# EAGLE design usb_blaster_rev_a (EAGLE 6.4)
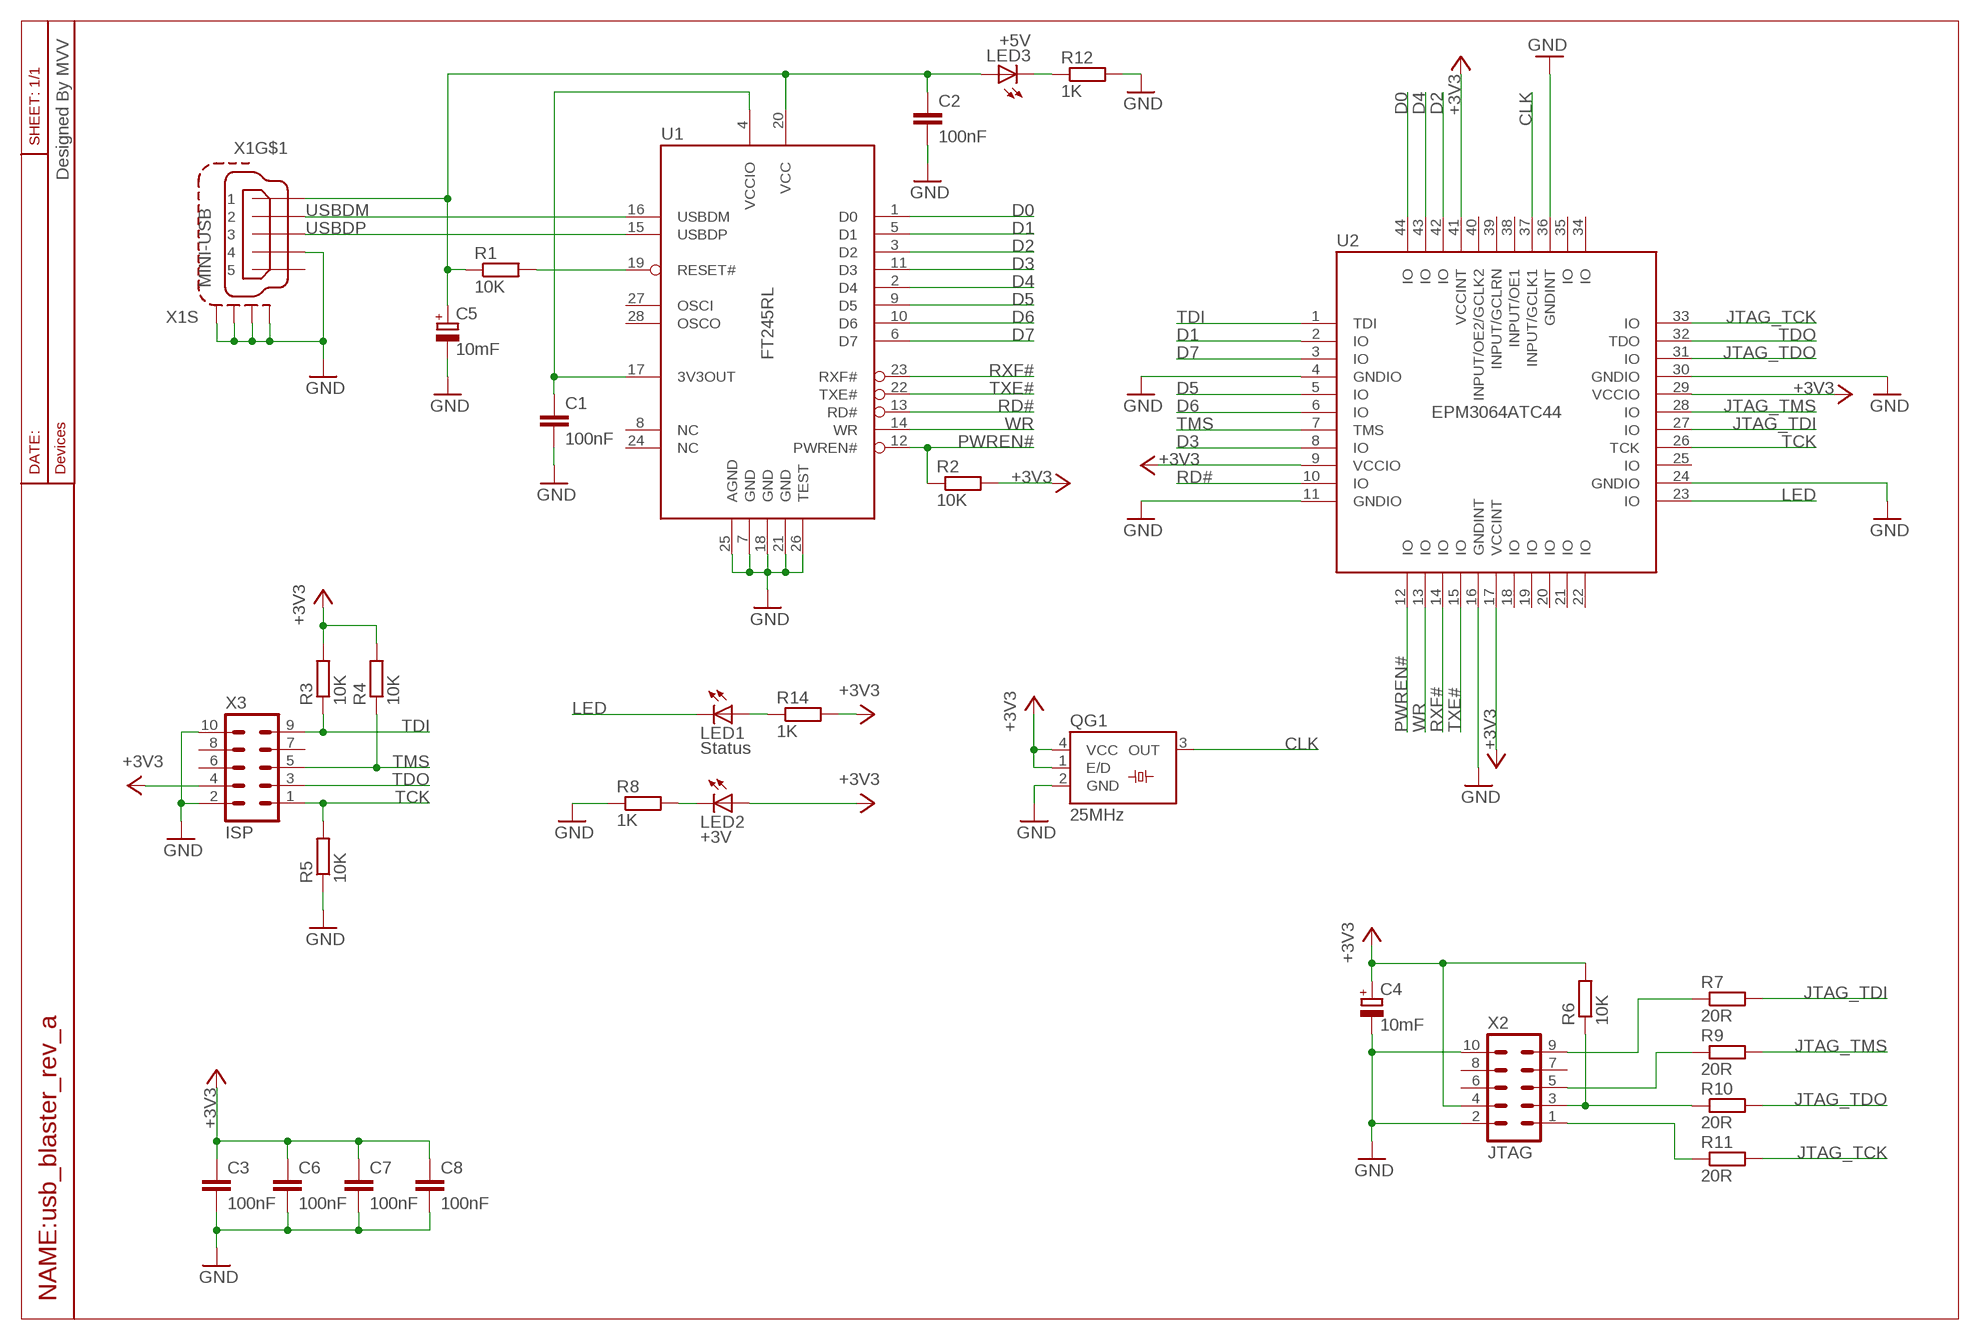
[diagram p0: schematic, sheet 1]

## Parts
C1  100nF  C-EUC0805  [C0805]
C2  100nF  C-EUC0805  [C0805]
C3  100nF  C-EUC0805  [C0805]
C4  10mF  CPOL-EUCT6032  [CT6032]
C5  10mF  CPOL-EUCT6032  [CT6032]
C6  100nF  C-EUC0805  [C0805]
C7  100nF  C-EUC0805  [C0805]
C8  100nF  C-EUC0805  [C0805]
LED1  Status  LED3MM  [LED3MM]
LED2  +3V  LED3MM  [LED3MM]
LED3  +5V  LED3MM  [LED3MM]
QG1  25MHz  SM77H  [SM77H]
R1  10K  R-EU_R0805  [R0805]
R2  10K  R-EU_R0805  [R0805]
R3  10K  R-EU_R0805  [R0805]
R4  10K  R-EU_R0805  [R0805]
R5  10K  R-EU_R0805  [R0805]
R6  10K  R-EU_R0805  [R0805]
R7  20R  R-EU_R0805  [R0805]
R8  1K  R-EU_R0805  [R0805]
R9  20R  R-EU_R0805  [R0805]
R10  20R  R-EU_R0805  [R0805]
R11  20R  R-EU_R0805  [R0805]
R12  1K  R-EU_R0805  [R0805]
R14  1K  R-EU_R0805  [R0805]
U1  FT245RL  [SSOP28]
U2  EPM3064ATC44  [TQFP44]
X1  MINI-USB  MINI-USB-SCHIELD-32005-201  [32005-201]
X2  JTAG  ML10  [ML10]
X3  ISP  MA05-2  [MA05-2]

## Nets
3V3OUT: C1.1 U1.4(VCCIO) U1.17(3V3OUT)
+3V3: C3.1 C4.+ C6.1 C7.1 C8.1 LED2.A QG1.1(E/D) QG1.4(VCC) R2.2 R3.2 R4.2 R6.2 R14.2 U2.9(VCCIO) U2.17(VCCINT) U2.29(VCCIO) U2.41(VCCINT) X2.4 X3.4
+5V: C2.1 C5.+ LED3.A R1.1 U1.20(VCC) X1.1
CLK: QG1.3(OUT) U2.37(INPUT/GCLK1)
D0: U1.1(D0) U2.44(IO)
D1: U1.5(D1) U2.2(IO)
D2: U1.3(D2) U2.42(IO)
D3: U1.11(D3) U2.8(IO)
D4: U1.2(D4) U2.43(IO)
D5: U1.9(D5) U2.5(IO)
D6: U1.10(D6) U2.6(IO)
D7: U1.6(D7) U2.3(IO)
GND: C1.2 C2.2 C3.2 C4.- C5.- C6.2 C7.2 C8.2 QG1.2(GND) R5.1 R8.1 R12.2 U1.7(GND) U1.18(GND) U1.21(GND) U1.25(AGND) U1.26(TEST) U2.4(GNDIO) U2.11(GNDIO) U2.16(GNDINT) U2.24(GNDIO) U2.30(GNDIO) U2.36(GNDINT) X1.4 X1.M1(S:S1) X1.M2(S:S2) X1.M3(S:S3) X1.M4(S:S4) X2.2 X2.10 X3.2 X3.10
JTAG_TCK: R11.2 U2.33(IO)
JTAG_TDI: R7.2 U2.27(IO)
JTAG_TDO: R10.2 U2.31(IO)
JTAG_TMS: R9.2 U2.28(IO)
LED: LED1.K(C) U2.23(IO)
N$1: LED3.K(C) R12.1
N$2: R1.2 U1.19(RESET#)
N$3: R7.1 X2.9
N$4: R11.1 X2.1
N$5: R6.1 R10.1 X2.3
N$6: R9.1 X2.5
N$7: LED2.K(C) R8.2
N$10: LED1.A R14.1
PWREN#: R2.1 U1.12(PWREN#) U2.12(IO)
RD#: U1.13(RD#) U2.10(IO)
RXF#: U1.23(RXF#) U2.14(IO)
TCK: R5.2 U2.26(TCK) X3.1
TDI: R3.1 U2.1(TDI) X3.9
TDO: U2.32(TDO) X3.3
TMS: R4.1 U2.7(TMS) X3.5
TXE#: U1.22(TXE#) U2.15(IO)
USBDM: U1.16(USBDM) X1.2
USBDP: U1.15(USBDP) X1.3
WR: U1.14(WR) U2.13(IO)
Unconnected: U1.8(NC) U1.24(NC) U1.27(OSCI) U1.28(OSCO) U2.18(IO) U2.19(IO) U2.20(IO) U2.21(IO) U2.22(IO) U2.25(IO) U2.34(IO) U2.35(IO) U2.38(INPUT/OE1) U2.39(INPUT/GCLRN) U2.40(INPUT/OE2/GCLK2) X1.5 X2.6 X2.7 X2.8 X3.6 X3.7 X3.8

## Notes on the sheet
- Designed By MVV

## Library data of the parts
C1-C3 C6-C8 = rcl:C-EU: CAPACITOR, European symbol
C4 C5 = rcl:CPOL-EU: POLARIZED CAPACITOR, European symbol
LED1-LED3 = led:LED: LED OSRAM: - CHIPLED LG R971, LG N971, LY N971, LG Q971, LY Q971, LO R971, LY R971 LH N974, LH R974 LS Q976, LO Q976, LY Q976 LO Q996 - Hyper CHIPLED LW Q18S LB Q993, LB Q99A, LB R99A - SideLED LS A670, LO A670, LY A670, LG A670, LP A670 LB A673, LV A673, LT A673, LW A673 LH A674 LY A675 LS A676, LA A676, LO A676, LY A676, LW A676 LS A679, LY A679, LG A679 - Hyper Micro SIDELED® LS Y876, LA Y876, LO Y876, LY Y876 LT Y87S - SmartLED LW L88C, LW L88S LB L89C, LB L89S, LG L890 LS L89K, LO L89K, LY L89K LS L896, LA L896, LO L896, LY L896 - TOPLED LS T670, LO T670, LY T670, LG T670, LP T670 LSG T670, LSP T670, LSY T670, LOP T670, LYG T670 LG T671, LOG T671, LSG T671 LB T673, LV T673, LT T673, LW T673 LH T674 LS T676, LA T676, LO T676, LY T676, LB T676, LH T676, LSB T676, LW T676 LB T67C, LV T67C, LT T67C, LS T67K, LO T67K, LY T67K, LW E67C LS E67B, LA E67B, LO E67B, LY E67B, LB E67C, LV E67C, LT E67C LW T67C LS T679, LY T679, LG T679 LS T770, LO T770, LY T770, LG T770, LP T770 LB T773, LV T773, LT T773, LW T773 LH T774 LS E675, LA E675, LY E675, LS T675 LS T776, LA T776, LO T776, LY T776, LB T776 LHGB T686 LT T68C, LB T68C - Hyper Mini TOPLED® LB M676 - Mini TOPLED Santana® LG M470 LS M47K, LO M47K, LY M47K Source: http://www.osram.convergy.de LUXEON: - LUMILED® LXK2-PW12-R00, LXK2-PW12-S00, LXK2-PW14-U00, LXK2-PW14-V00 LXK2-PM12-R00, LXK2-PM12-S00, LXK2-PM14-U00 LXK2-PE12-Q00, LXK2-PE12-R00, LXK2-PE12-S00, LXK2-PE14-T00, LXK2-PE14-U00 LXK2-PB12-K00, LXK2-PB12-L00, LXK2-PB12-M00, LXK2-PB14-N00, LXK2-PB14-P00, LXK2-PB14-Q00 LXK2-PR12-L00, LXK2-PR12-M00, LXK2-PR14-Q00, LXK2-PR14-R00 LXK2-PD12-Q00, LXK2-PD12-R00, LXK2-PD12-S00 LXK2-PH12-R00, LXK2-PH12-S00 LXK2-PL12-P00, LXK2-PL12-Q00, LXK2-PL12-R00 Source: www.luxeon.com KINGBRIGHT: KA-3528ASYC Source: www.kingbright.com
QG1 = crystal:SM77H: 3.3V CMOS Clock Oscillator Source: www.pletronics.com .. sm77h%203.3v.pdf
R1-R12 R14 = rcl:R-EU_: RESISTOR, European symbol
U1 = ftdichip:FT245R: Single chip USB to parallel FIFO bidirectional data transfer interface.
U2 = altera:EPM3064ATC44: EPM3064A
X1 = con-cypressindustries:MINI-USB-SCHIELD-: MINI USB-B Conector Source: www.cypressindustries.com; OC_FARNELL: unknown; OC_NEWARK: unknown
X2 = con-ml:ML10: HARTING
X3 = con-lstb:MA05-2: PIN HEADER; OC_FARNELL: unknown; OC_NEWARK: unknown

## Board
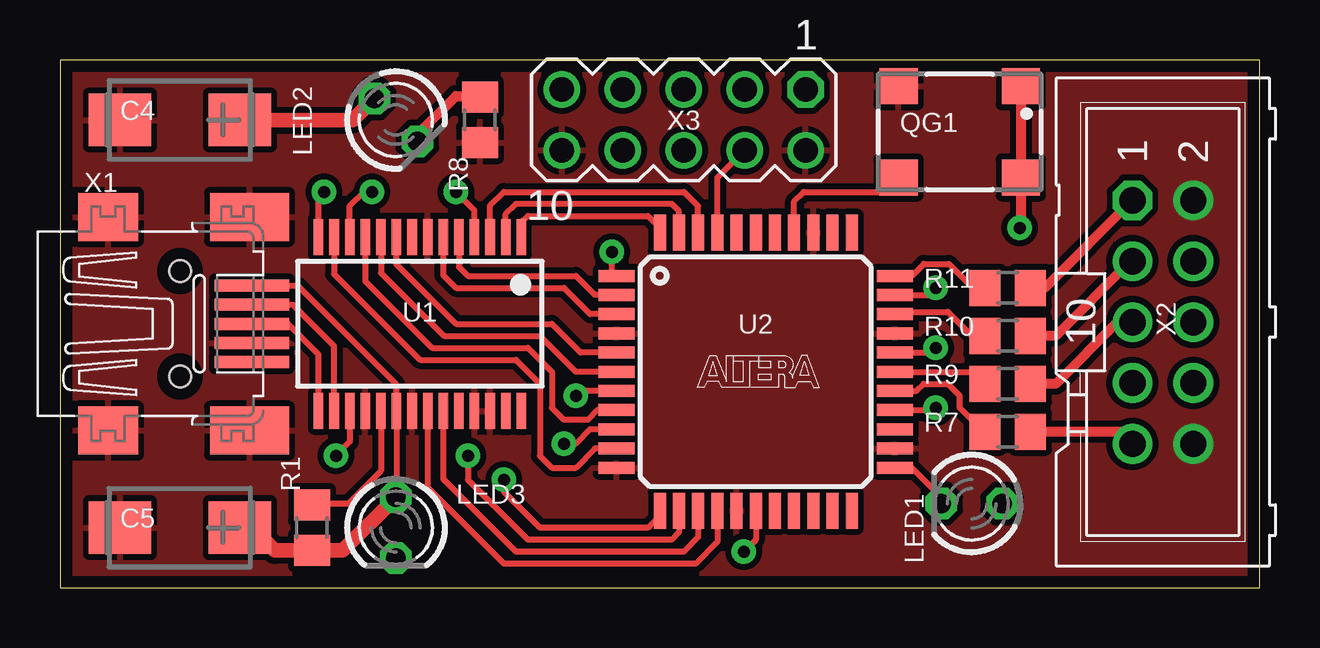
[diagram p1: board, top side]
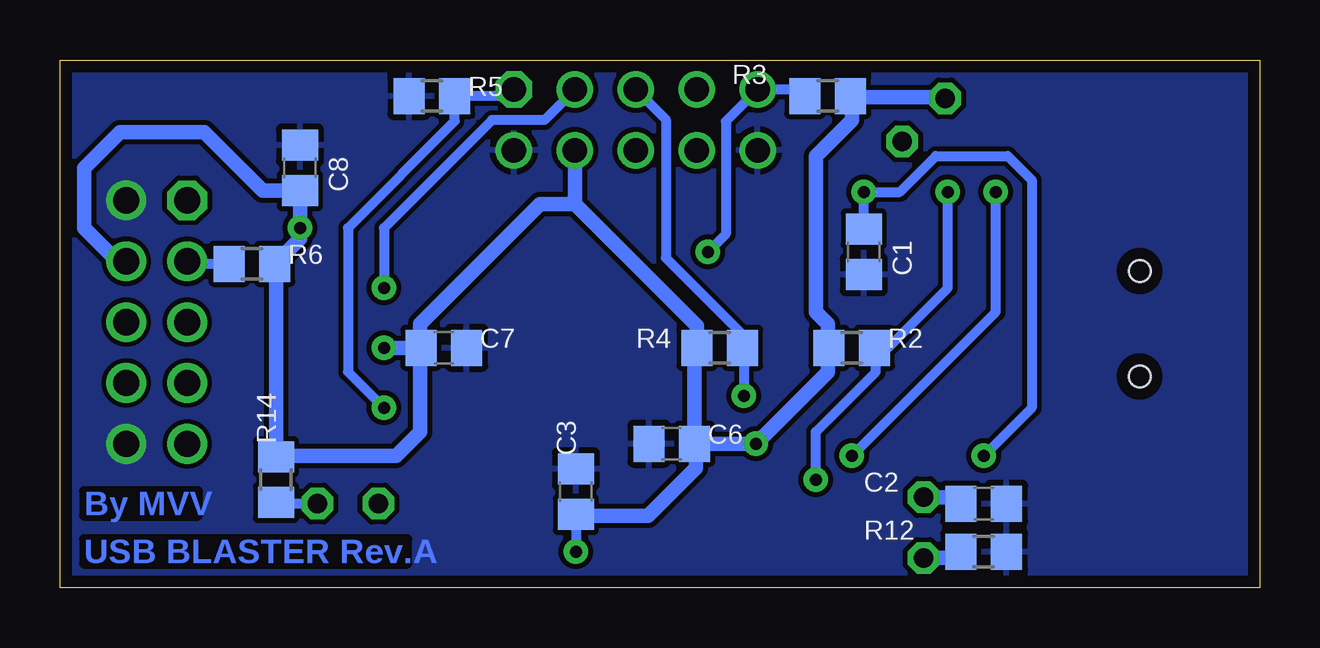
[diagram p2: board, bottom side, seen from below]

Size 50 x 22 mm. Coordinates in mm from the lower left corner, seen from the top.
Outline: 0,0 50,0 50,22 0,22 0,0
Copper layers (1*16): Top 0.035mm / dielectric 1.5mm / Bottom 0.035mm
Design rules "default *": minimum track width 10mil, minimum drill 24mil, track to track 8mil, track to pad 8mil, pad to pad 8mil, via to via 8mil, smd to smd 8mil, copper to edge 0.5mm, drill to drill 8mil, minimum pad ring 10mil, minimum via ring 8mil, stop-mask expansion 4mil, vias tented up to drill 0mil, thermal gap 10mil

### Footprints (pad centres in the part's own frame; a part is rotated, then mirrored left to right if it is on the bottom)
C0805 = smd 1.3 x 1.5: 1 -0.95,0; 2 0.95,0
CT6032 = smd 2.6 x 2.2: + -2.5,0; - 2.5,0
LED3MM = drill 0.813 octagon: A -1.27,0; K 1.27,0
SM77H = smd 1.6 x 1.5: 1 -2.55,-1.9; 2 2.55,-1.9; 3 2.55,1.9; 4 -2.55,1.9
R0805 = smd 1.3 x 1.5: 1 -0.95,0; 2 0.95,0
SSOP28 = smd 0.4 x 1.5: 1 -4.225,-3.625; 2 -3.575,-3.625; 3 -2.925,-3.625; 4 -2.275,-3.625; 5 -1.625,-3.625; 6 -0.975,-3.625; 7 -0.325,-3.625; 8 0.325,-3.625; 9 0.975,-3.625; 10 1.625,-3.625; 11 2.275,-3.625; 12 2.925,-3.625; 13 3.575,-3.625; 14 4.225,-3.625; 15 4.225,3.625; 16 3.575,3.625; 17 2.925,3.625; 18 2.275,3.625; 19 1.625,3.625; 20 0.975,3.625; 21 0.325,3.625; 22 -0.325,3.625; 23 -0.975,3.625; 24 -1.625,3.625; 25 -2.275,3.625; 26 -2.925,3.625; 27 -3.575,3.625; 28 -4.225,3.625
TQFP44 = smd 1.5 x 0.5: 1 -5.8,4; 2 -5.8,3.2; 3 -5.8,2.4; 4 -5.8,1.6; 5 -5.8,0.8; 6 -5.8,0; 7 -5.8,-0.8; 8 -5.8,-1.6; 9 -5.8,-2.4; 10 -5.8,-3.2; 11 -5.8,-4; 23 5.8,-4; 24 5.8,-3.2; 25 5.8,-2.4; 26 5.8,-1.6; 27 5.8,-0.8; 28 5.8,0; 29 5.8,0.8; 30 5.8,1.6; 31 5.8,2.4; 32 5.8,3.2; 33 5.8,4 | smd 0.5 x 1.5: 12 -4,-5.8; 13 -3.2,-5.8; 14 -2.4,-5.8; 15 -1.6,-5.8; 16 -0.8,-5.8; 17 0,-5.8; 18 0.8,-5.8; 19 1.6,-5.8; 20 2.4,-5.8; 21 3.2,-5.8; 22 4,-5.8; 34 4,5.8; 35 3.2,5.8; 36 2.4,5.8; 37 1.6,5.8; 38 0.8,5.8; 39 0,5.8; 40 -0.8,5.8; 41 -1.6,5.8; 42 -2.4,5.8; 43 -3.2,5.8; 44 -4,5.8
32005-201 = smd 3.1 x 0.5: 1 3,1.6; 2 3,0.8; 3 3,0; 4 3,-0.8; 5 3,-1.6 | smd 2.5 x 2: M1 -3,-4.45; M2 -3,4.45 | smd 3.3 x 2: M3 2.9,4.45; M4 2.9,-4.45 | hole 0.9: 0,2.2; 0,-2.2
ML10 = drill 1.1 octagon: 1 -5.08,-1.27 | drill 1.1: 2 -5.08,1.27; 3 -2.54,-1.27; 4 -2.54,1.27; 5 0,-1.27; 6 0,1.27; 7 2.54,-1.27; 8 2.54,1.27; 9 5.08,-1.27; 10 5.08,1.27
MA05-2 = drill 1.016 octagon: 1 -5.08,-1.27 | drill 1.016: 2 -5.08,1.27; 3 -2.54,-1.27; 4 -2.54,1.27; 5 0,-1.27; 6 0,1.27; 7 2.54,-1.27; 8 2.54,1.27; 9 5.08,-1.27; 10 5.08,1.27

### Placement (x,y rotation side)
C1  16.5,14 270 bottom
C2  11.5,3.5 0 bottom
C3  28.5,4 90 bottom
C4  5,19.5 180 top
C5  5,2.5 180 top
C6  24.5,6 180 bottom
C7  34,10 0 bottom
C8  40,17.5 90 bottom
LED1  38,3.5 180 top
LED2  14,19.5 315 top
LED3  14,2.5 270 top
QG1  37.5,19 180 top
R1  10.5,2.5 90 top
R2  17,10 180 bottom
R3  18,20.5 0 bottom
R4  22.5,10 180 bottom
R5  34.5,20.5 0 bottom
R6  42,13.5 0 bottom
R7  39.5,6.5 180 top
R8  17.5,19.5 90 top
R9  39.5,8.5 180 top
R10  39.5,10.5 180 top
R11  39.5,12.5 180 top
R12  11.5,1.5 0 bottom
R14  41,4.5 90 bottom
U1  15,11 180 top
U2  29,9 0 top
X1  5,11 0 top
X2  45.97,11.07 270 top
X3  26,19.5 180 top

### Tracks (layer width: path | path; a pad name or v marks a point on that pad's centre or on a via)
3V3OUT  (via drill 0.5 pad 1.02)
  Top 0.25: U1.4 17.27,15.72 v16.5,16.5 | U1.17 12.07,6.08 v11.5,5.5
  Bottom 0.406: v11.5,5.5 9.5,7.5 9.5,17 10.5,18 13.5,18 15,16.5 v16.5,16.5 C1.1
+3V3  (via drill 0.5 pad 1.02)
  Top 0.25: U2.17 29,2 v28.5,1.5 | U2.9 22.1,6.6 21.5,6 v21,6 | U2.29 36.3,9.8 v36.5,10 | U2.41 27.4,17.09 X3.4
  Top 0.406: QG1.1 QG1.4 40.05,15.05 v40,15
  Top 0.61: C4.+ 12.2,19.5 LED2.A
  Bottom 0.406: v28.5,1.5 C3.1 28.45,3 | 23.5,10 R4.2 23.55,9.4 | R6.2 41,13.45 | 35,10.05 C7.1 35.5,10 35.3,9.8 U2.29 35,9.6 | 40.95,5.5 R14.2 | 13.15,20.45 LED2.A | 17,20.45 R3.2 | 18,9.45 R2.2 18,9.55
  Bottom 0.61: C6.1 v21,6 18,9 18,9.45 | R6.2 40,14.55 v40,15 C8.1 41.55,16.55 44,19 47.5,19 49,17.5 49,15 47.61,13.61 X2.4 | 23.55,9.4 C6.1 | 28.54,16 30,16 35,11 35,10.05 | 41,13.45 R14.2 | 28.54,16 23.45,10.91 R4.2 | 28.54,16 X3.4 | 40.95,5.5 36,5.5 35,6.5 35,9.6 | 35.5,10 v36.5,10 | 13.15,20.45 17,20.45 17,19.5 18.5,18 18.5,11.5 18,11 18,9.55 | 28.45,3 25.5,3 23.5,5 23.5,5.95 C6.1
+5V
  Top 0.25: X1.1 9.9,12.6 14,8.5 14,7.4 U1.20 14.03,3.79 LED3.A
  Top 0.61: LED3.A 11.78,1.55 R1.1 8.95,1.55 8,2.5 C5.+
  Bottom 0.25: C2.1 12.72,3.77
  Bottom 0.61: 12.72,3.77 LED3.A
CLK
  Top 0.25: U2.37 30.6,16.1 31,16.5 34.35,16.5 QG1.3
D0
  Top 0.25: U1.1 19.23,15.22 19.5,15.5 24.5,15.5 25,15 U2.44
D1
  Top 0.25: U1.5 16.62,13.38 17,13 21.5,13 22.3,12.2 U2.2
D2
  Top 0.25: U1.3 17.93,15.93 18.5,16.5 26,16.5 26.6,15.9 U2.42
D3
  Top 0.25: U2.8 22.4,7.4 22,7 21,7 20.5,7.5 20.5,9 19.5,10 15.5,10 12.72,12.78 U1.11
D4
  Top 0.25: U2.43 25.8,15.7 25.5,16 19,16 18.57,15.57 U1.2
D5
  Top 0.25: U2.5 21.7,9.8 20.5,11 16.5,11 14.03,13.47 U1.9
D6
  Top 0.25: U2.6 21.5,9 20,10.5 16,10.5 13.38,13.12 U1.10
D7
  Top 0.25: U1.6 15.97,13.03 16.5,12.5 21,12.5 22.1,11.4 U2.3
GND
  pour Top (isolate 0.254): 0,22 50,22 50,0 0,0
  pour Bottom: 0,22 50,22 50,0 0,0
JTAG_TCK
  Top 0.25: U2.33 35.5,13 36,13.5 37.05,13.5 38.05,12.5 R11.2
JTAG_TDI
  Top 0.25: U2.27 35.7,8.2 36,8.5 37,8.5 37.5,8 37.5,7.5 38.5,6.5 R7.2
JTAG_TDO
  Top 0.25: U2.31 34.9,11.5 37,11.5 38,10.5 R10.2 38.5,10.5
JTAG_TMS
  Top 0.25: U2.28 38.05,9 R9.2
LED
  Top 0.25: U2.23 35.5,5 36.5,4 37,3.5 LED1.K
N$1
  Bottom 0.25: R12.1 12.72,1.23
  Bottom 0.61: 12.72,1.23 LED3.K
N$2
  Top 0.25: U1.19 13.38,4.88 12,3.5 10.55,3.5 R1.2
N$3
  Top 0.406: X2.9 44.19,6.5 R7.1
N$4
  Top 0.406: X2.1 41.05,12.5 R11.1
N$5
  Top 0.25: X2.3 44.61,13.61
  Top 0.406: 44.61,13.61 41.5,10.5 R10.1
  Bottom 0.406: R6.1 44.59,13.5 X2.3
N$6
  Top 0.406: X2.5 44.07,11.07 41.5,8.5 R9.1
N$7
  Top 0.406: LED2.K 14.9,18.9 16.5,20.5 17.45,20.5 R8.2
N$10
  Bottom 0.406: LED1.A 40.95,3.5 R14.1
PWREN#  (via drill 0.5 pad 1.02)
  Top 0.25: U1.12 12.07,15.93 12.65,16.5 v13,16.5 | v18.5,4.5 18.5,4 20,2.5 24.5,2.5 25,3 U2.12
  Bottom 0.406: v18.5,4.5 18.5,6.5 16,9 16,9.45 | 16,9.45 R2.1 | 16,9.45 16,9.5 13,12.5 v13,16.5
RD#
  Top 0.25: U2.10 22.3,5.8 21.5,5 20.5,5 20,5.5 20,8.5 19,9.5 15,9.5 11.43,13.07 U1.13
RXF#
  Top 0.25: U2.14 26.6,2.1 26,1.5 19,1.5 15.97,4.53 U1.23
TCK  (via drill 0.5 pad 1.02)
  Top 0.25: U2.26 36.4,7.4 v36.5,7.5
  Bottom 0.406: X3.1 31.35,20.5 R5.2 33.55,19.45 38,15 38,9 v36.5,7.5
TDI  (via drill 0.5 pad 1.02)
  Top 0.25: U2.1 23,13.2 v23,14
  Bottom 0.406: v23,14 22.25,14.75 22.25,19.44 X3.9 18.82,20.77 R3.1
TDO  (via drill 0.5 pad 1.02)
  Top 0.25: U2.32 36.2,12.2 v36.5,12.5
  Bottom 0.406: X3.3 29.81,19.5 32,19.5 36.5,15 v36.5,12.5
TMS  (via drill 0.5 pad 1.02)
  Top 0.25: U2.7 21.5,8.2 v21.5,8
  Bottom 0.406: v21.5,8 21.5,9.45 R4.1 21.55,10.55 24.75,13.75 24.75,19.52 X3.5
TXE#
  Top 0.25: U2.15 27.4,1.9 26.5,1 18.5,1 15.32,4.17 U1.22
USBDM
  Top 0.25: X1.2 9.7,11.8 11.43,10.07 U1.16
USBDP
  Top 0.25: 10.78,7.72 U1.15 10.78,9.72 9.5,11 X1.3
WR  (via drill 0.5 pad 1.02)
  Top 0.25: U1.14 10.78,16.27 v11,16.5 | U2.13 25.8,2.3 25.5,2 19.5,2 17,4.5 v17,5.5
  Bottom 0.406: v17,5.5 11,11.5 v11,16.5

### Text on the board
Bottom: By MVV | USB BLASTER Rev.A